# Altium schematic sheet FPGA_Z80_Counter.SchDoc: LiveDesign Evaluation - Counter
size B; Organization: Altium Limited; Address1: L3, 12a Rodborough Rd; Address2: Frenchs Forest; Address3: NSW; Address4: Australia 2086; DocumentNumber: 1; SheetNumber: 1; SheetTotal: 2
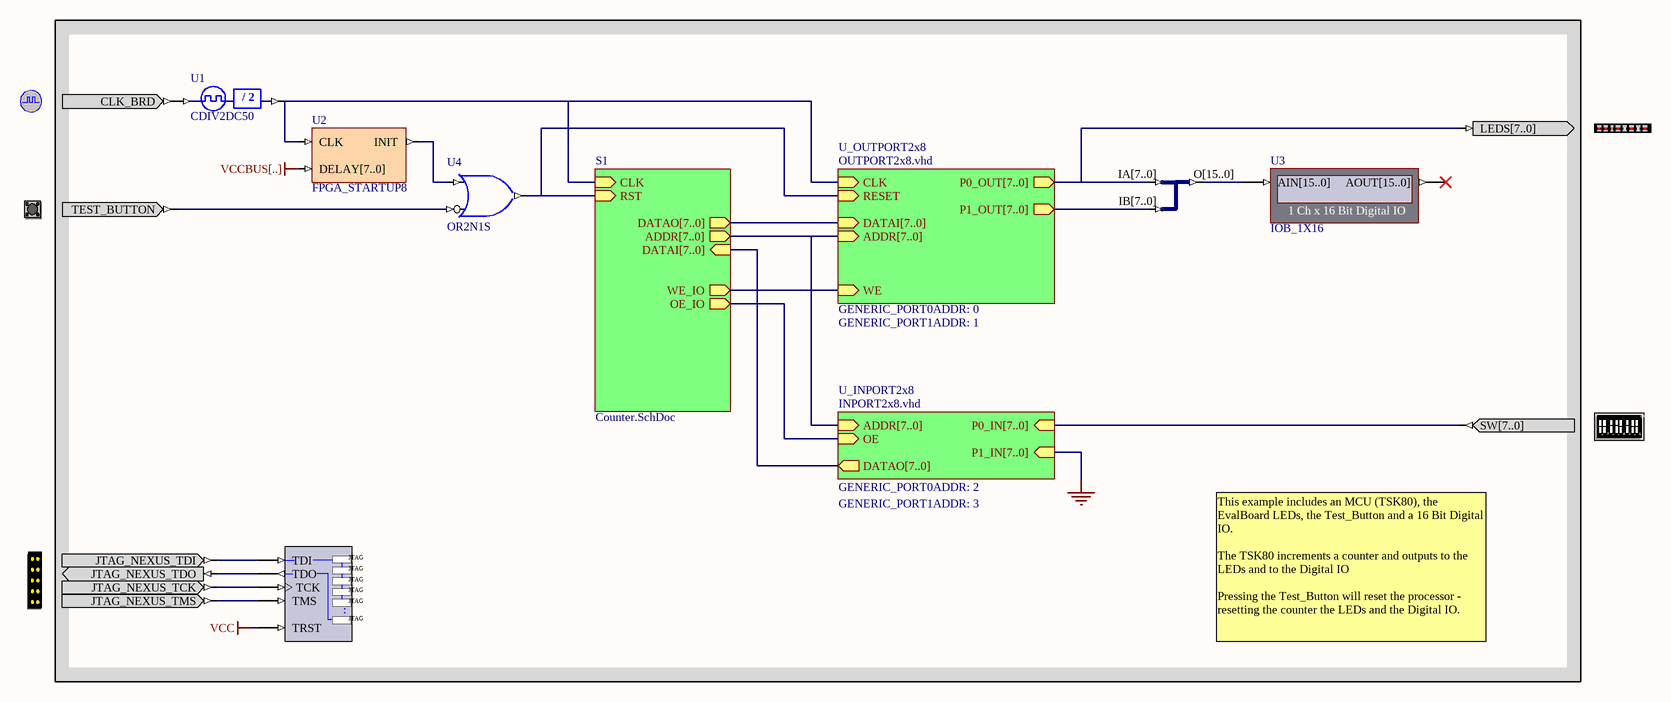
[diagram p0: FPGA_Z80_Counter.SchDoc]

## Parts
CLOCK_BOARD  CLOCK_BOARD  (value not drawn)
DIPSWITCH  DIPSWITCH  (value not drawn)
LED  LED  (value not drawn)
NEXUS_JTAG_CONNECTOR  NEXUS_JTAG_CONNECTOR  (value not drawn)
NEXUS_JTAG_PORT  NEXUS_JTAG_PORT  (value not drawn)
TEST_BUTTON  TEST_BUTTON  (value not drawn)
U1  CDIV2DC50
U2  FPGA_STARTUP8
U3  IOB_1X16
U4  OR2N1S
U5  J8B2_16B  (value not drawn)

## Sub-sheets
S1 = Counter.SchDoc: CLK (in), RST (in), DATAO[7..0] (out), ADDR[7..0] (out), OE_IO (out), DATAI[7..0] (in), WE_IO (out)
U_INPORT2x8 = INPORT2x8.vhd: ADDR[7..0] (in), DATAO[7..0] (out), OE (in), P0_IN[7..0] (in), P1_IN[7..0] (in)  | VHDLENTITY: INPORT2x8; GENERIC_PORT0ADDR: 2; GENERIC_PORT1ADDR: 3
U_OUTPORT2x8 = OUTPORT2x8.vhd: ADDR[7..0] (in), CLK (in), DATAI[7..0] (in), P0_OUT[7..0] (out), P1_OUT[7..0] (out), RESET (in), WE (in)  | VHDLENTITY: OUTPORT2x8; GENERIC_PORT0ADDR: 0; GENERIC_PORT1ADDR: 1

## Nets
VCC: NEXUS_JTAG_PORT.TRST
VCCBUS[..]: U2.DELAY[7..0]
NetCLOCK_BOARD_CLK_BRD: CLOCK_BOARD.CLK_BRD U1.CLKIN
NetDIPSWITCH_SW[7..0]: DIPSWITCH.SW[7..0] ; sheet U_INPORT2x8/P0_IN[7..0]
NetLED_LEDS[7..0]: LED.LEDS[7..0] U5.IA[7..0] ; sheet U_OUTPORT2x8/P0_OUT[7..0]
NetNEXUS_JTAG_CONNECTOR_JTAG_NEXUS_TCK: NEXUS_JTAG_CONNECTOR.JTAG_NEXUS_TCK NEXUS_JTAG_PORT.TCK
NetNEXUS_JTAG_CONNECTOR_JTAG_NEXUS_TDI: NEXUS_JTAG_CONNECTOR.JTAG_NEXUS_TDI NEXUS_JTAG_PORT.TDI
NetNEXUS_JTAG_CONNECTOR_JTAG_NEXUS_TDO: NEXUS_JTAG_CONNECTOR.JTAG_NEXUS_TDO NEXUS_JTAG_PORT.TDO
NetNEXUS_JTAG_CONNECTOR_JTAG_NEXUS_TMS: NEXUS_JTAG_CONNECTOR.JTAG_NEXUS_TMS NEXUS_JTAG_PORT.TMS
NetTEST_BUTTON_TEST_BUTTON: TEST_BUTTON.TEST_BUTTON U4.I0
NetU1_CLKDV: U1.CLKDV U2.CLK ; sheet S1/CLK, sheet U_OUTPORT2x8/CLK
NetU2_INIT: U2.INIT U4.I1
NetU3_AIN[15..0]: U3.AIN[15..0] U5.O[15..0]
NetU4_O: U4.O ; sheet S1/RST, sheet U_OUTPORT2x8/RESET
NetU5_IB[7..0]: U5.IB[7..0] ; sheet U_OUTPORT2x8/P1_OUT[7..0]
(unnamed): sheet S1/OE_IO, sheet U_INPORT2x8/OE
(unnamed): sheet S1/WE_IO, sheet U_OUTPORT2x8/WE

Not connected (* = marked no-connect by the designer): U3 AOUT[15..0]*

## Buses and harness runs
bus sheet S1/ADDR[7..0] = sheet U_INPORT2x8/ADDR[7..0] = sheet U_OUTPORT2x8/ADDR[7..0]
bus sheet S1/DATAI[7..0] = sheet U_INPORT2x8/DATAO[7..0]
bus sheet S1/DATAO[7..0] = sheet U_OUTPORT2x8/DATAI[7..0]

## Notes on the sheet
- This example includes an MCU (TSK80), the EvalBoard LEDs, the Test_Button and a 16 Bit Digital IO.
  The TSK80 increments a counter and outputs to the LEDs and to the Digital IO
  Pressing the Test_Button will reset the processor - resetting the counter the LEDs and the Digital IO.
- Title
- Size:
- Date:
- B
- Number:
- Time:
- Revision:
- Sheet
- of
- File:
- (in symbol CDIV2DC50) / 2
- (in symbol DIPSWITCH) ON; 8; 7; 6; 5; 4; 3; 2; 1
- (in symbol NEXUS_JTAG_PORT) JTAG; .

## Library data of the parts
CLOCK_BOARD = CLOCK_BOARD: Global System Clock Supply; PortComponent: True; Published: 19-Nov-2003; Publisher: Altium Limited
DIPSWITCH = DIPSWITCH: 8-Way Dip Switch; PortComponent: True; Published: 19-Nov-2003; Publisher: Altium Limited
LED = LED: 8-Way LEDS; PortComponent: True; Published: 19-Nov-2003; Publisher: Altium Limited
NEXUS_JTAG_CONNECTOR = NEXUS_JTAG_CONNECTOR: JTAG Port; PortComponent: True; Published: 19-Nov-2003; Publisher: Altium Limited
NEXUS_JTAG_PORT = NEXUS_JTAG_PORT: Soft Nexus-Chain Connector; NEXUS_JTAG_CONNECTOR: True; Published: 18-Dec-2003; Publisher: Altium Limited
TEST_BUTTON = TEST_BUTTON: Test Button; PortComponent: True; Published: 19-Nov-2003; Publisher: Altium Limited
U1 = CDIV2DC50: Clock Divider by 2 with 50% Duty Cycle Output; Xilinx Equivalent: CLK_DIV2; ArchiveName: GENERIC; VHDLIB_SIM: GENERIC_LIB; Published: 29-Jan-2004; Publisher: Altium Limited; Core Revision: 1.00.00
U2 = FPGA_STARTUP8: FPGA Startup With 8 Bit Delay; Published: 21/01/2004; Publisher: Altium Hobart Technology Centre; Core Revision: 1.00.00
U3 = IOB_1X16: 1 Ch x 16 Bit Digital IO; NEXUS_CORE: Instrument; NEXUS_JTAG_DEVICE: True; NEXUS_JTAG_ORDER: 0; Published: 30/09/2003; Publisher: Altium Hobart Technology Centre; Core Revision: 1.00.00
U4 = OR2N1S: 2-Input OR Gate with Active Low A Input, Single Pin Version; Xilinx Equivalent: OR2B1; ArchiveName: GENERIC; VHDLIB_SIM: GENERIC_LIB; Published: 29-Jan-2004; Publisher: Altium Limited; Core Revision: 1.00.00
U5 = J8B2_16B: 2 x 8-Bit input bus to 1 x 16-bit output bus; ArchiveName: GENERIC; VHDLIB_SIM: GENERIC_LIB; Published: 29-Jan-2004; Publisher: Altium Limited; Core Revision: 1.00.00